# EAGLE design encoder (EAGLE 5.07)
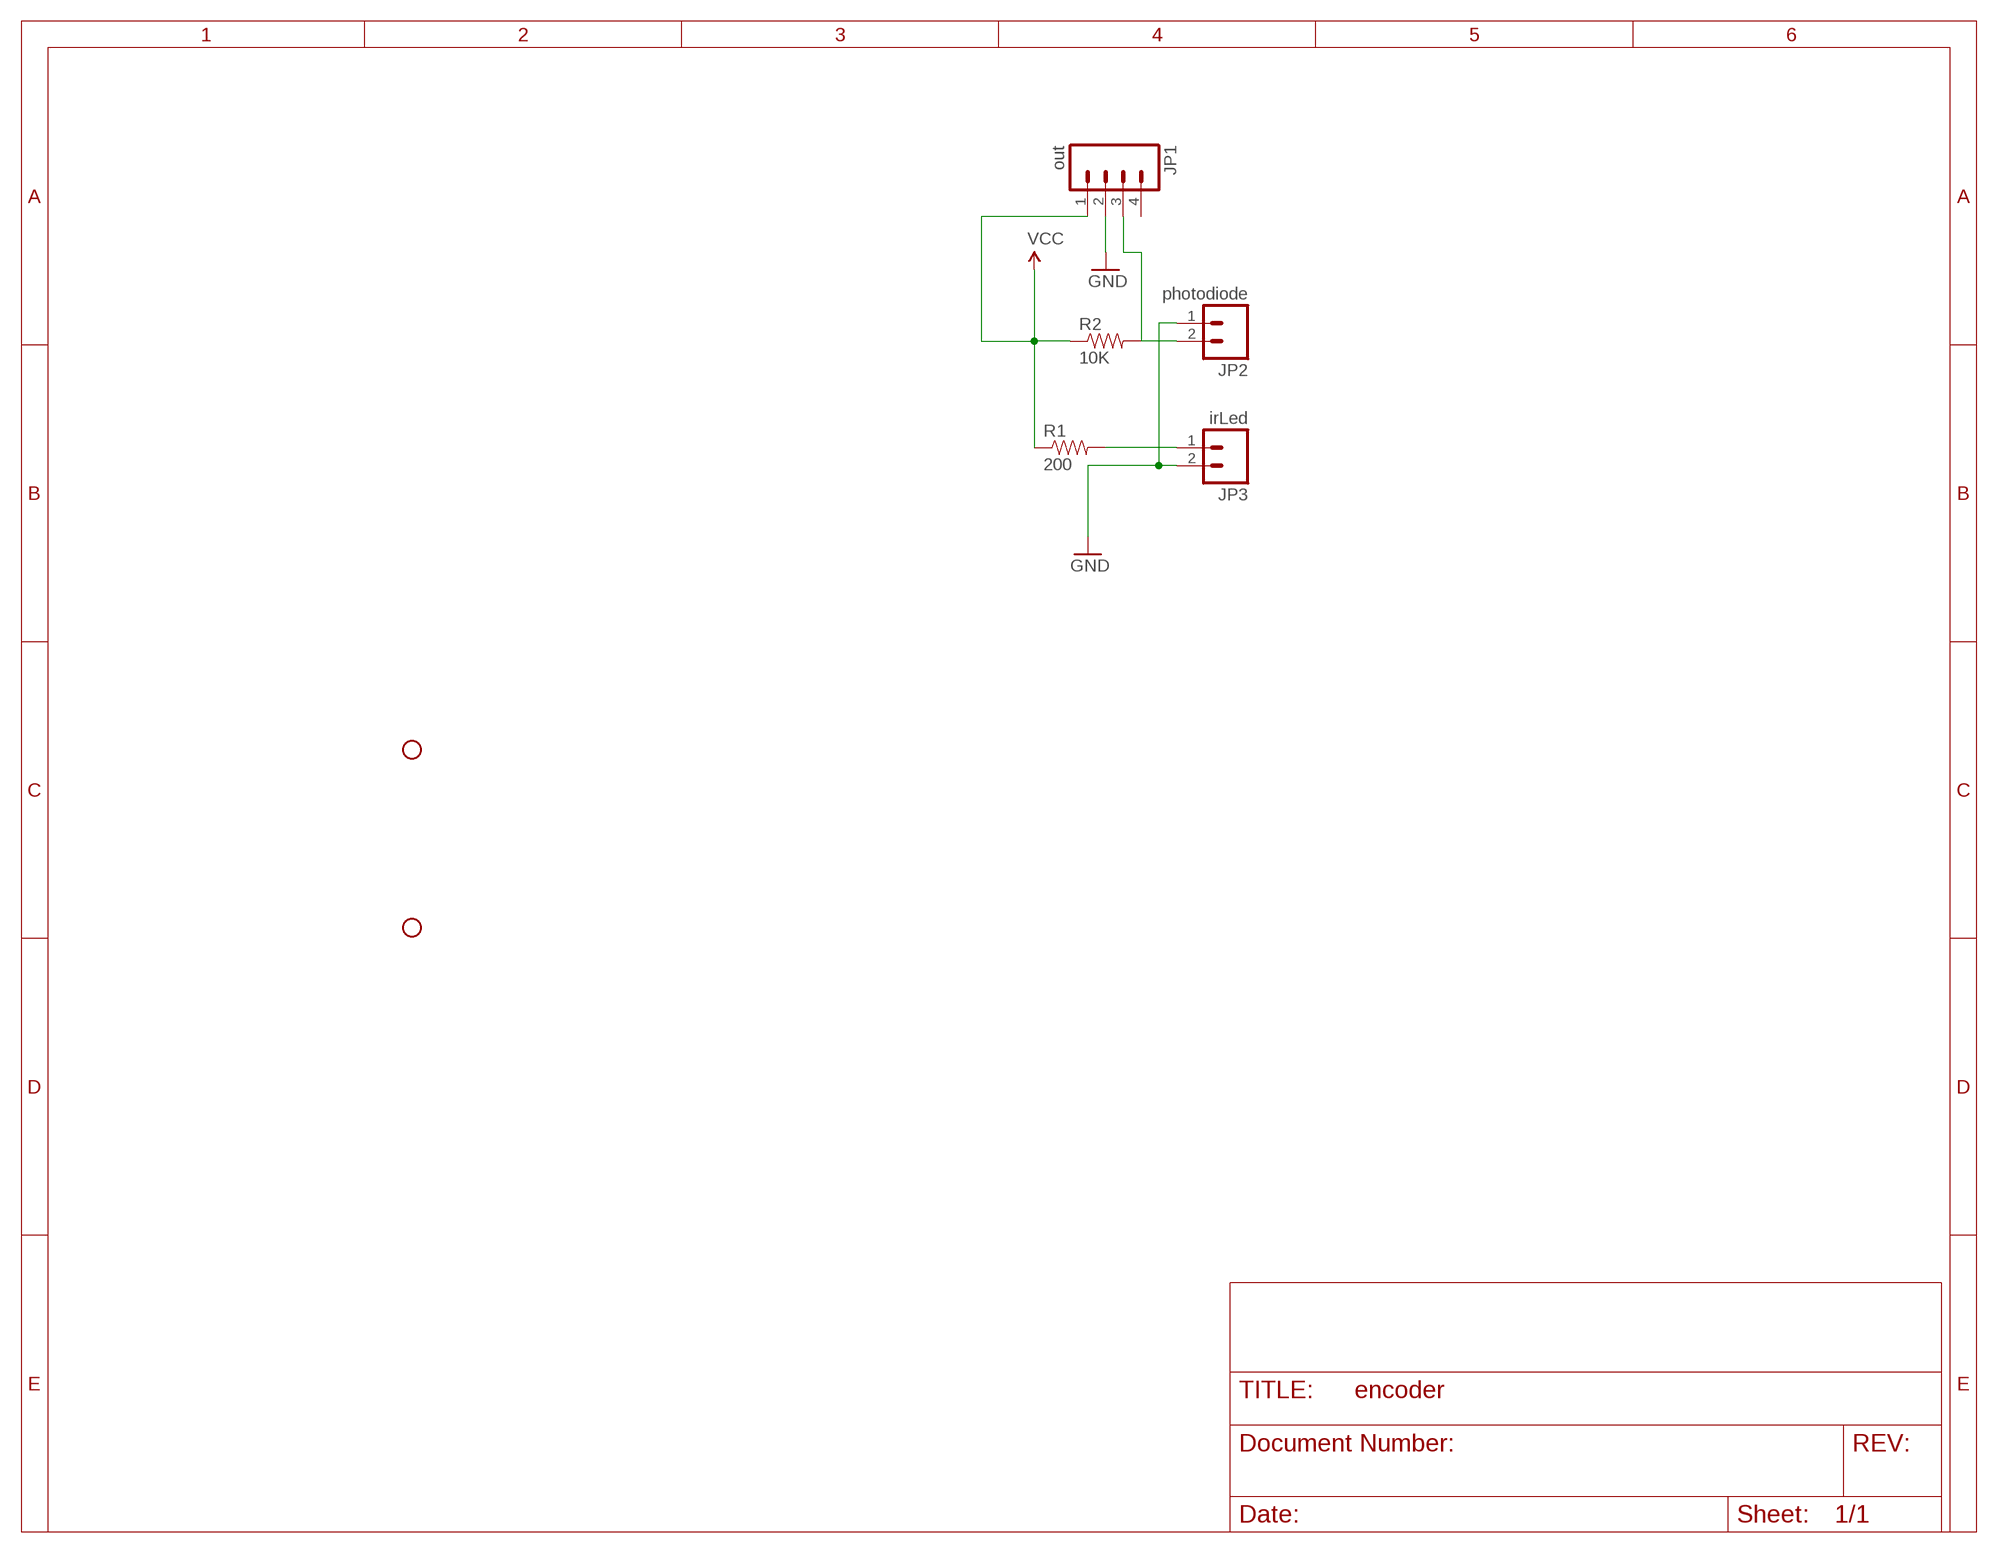
[diagram p0: schematic, sheet 1]

## Parts
JP1  out  M04POLAR  [MOLEX-1X4]
JP2  photodiode  M02PTH  [1X02]
JP3  irLed  M02PTH  [1X02]
JP9  STAND-OFF  [STAND-OFF]
JP10  STAND-OFF  [STAND-OFF]
R1  200  RESISTORPTH1  [AXIAL-0.3]
R2  10K  RESISTORPTH1  [AXIAL-0.3]

## Nets
GND: JP1.2 JP2.1 JP3.2
N$1: JP3.1 R1.P$2
N$2: JP1.3 JP2.2 R2.P$2
VCC: JP1.1 R1.P$1 R2.P$1
Unconnected: JP1.4

## Library data of the parts
JP1 = SparkFun:M04: Header 4 Standard 4-pin 0.1" header. Use with straight break away headers (SKU : PRT-00116), right angle break away headers (PRT-00553), swiss pins (PRT-00743), machine pins (PRT-00117), and female headers (PRT-00115). Molex polarized connector foot print use with SKU : PRT-08231 with associated crimp pins and housings.
JP2 JP3 = SparkFun:M02: Header 2 Standard 2-pin 0.1" header. Use with straight break away headers (SKU : PRT-00116), right angle break away headers (PRT-00553), swiss pins (PRT-00743), machine pins (PRT-00117), and female headers (PRT-00115). Molex polarized connector foot print use with SKU : PRT-08233 with associated crimp pins and housings.
JP9 JP10 = SparkFun:STAND-OFF: Stand Off This is the mechanical footprint for a #4 phillips button head screw. Use the keepout ring to avoid running the screw head into surrounding components. SKU : PRT-00447
R1 R2 = SparkFun:RESISTOR: Resistor Basic schematic elements and footprints for 0603, 1206, and PTH 1/10th watt (small) resistors.

## Net classes
0 signal: width 0.381 mm, drill 0.813 mm, clearance 0.254 mm
1 drive: width 1.778 mm, drill 0.813 mm, clearance 0.254 mm

## Board
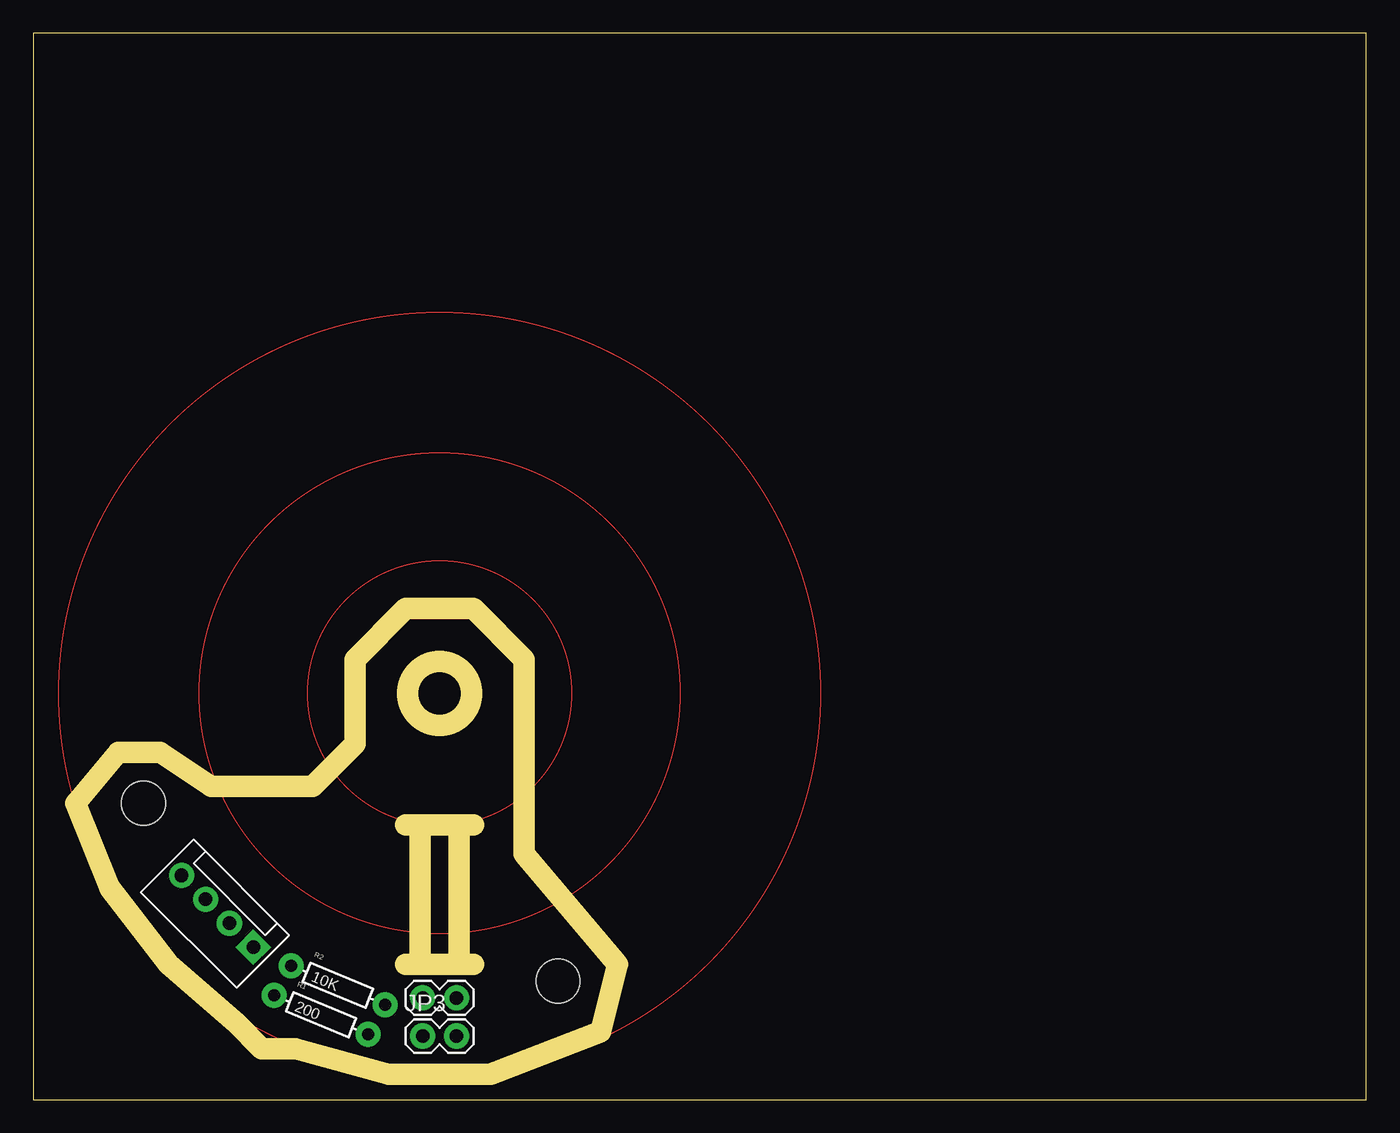
[diagram p1: board, top side]
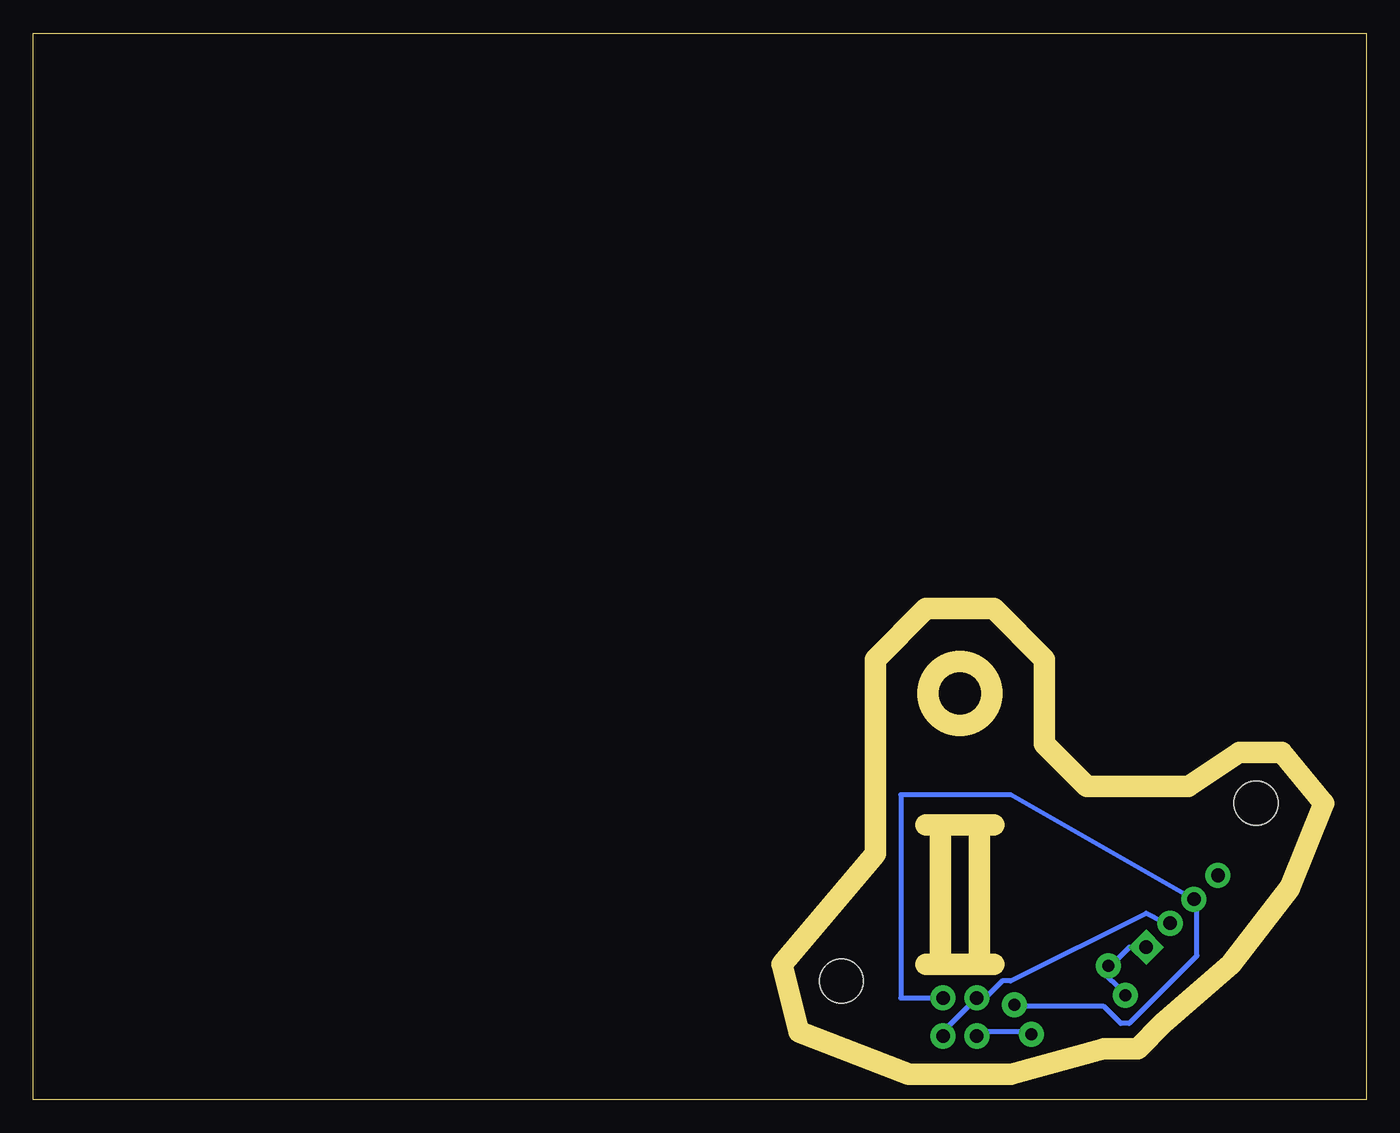
[diagram p2: board, bottom side, seen from below]

Size 100 x 80 mm. Coordinates in mm from the lower left corner, seen from the top.
Outline: 0,0 100,0 100,80 0,80 0,0
Copper layers (1*16): Top 0.035mm / dielectric 1.5mm / Bottom 0.035mm
Design rules "default *": minimum track width 15mil, minimum drill 24mil, track to track 15mil, track to pad 15mil, pad to pad 8mil, via to via 8mil, smd to smd 8mil, copper to edge 63mil, drill to drill 8mil, minimum pad ring 10mil, minimum via ring 8mil, stop-mask expansion 4mil, vias tented up to drill 0mil, thermal gap 10mil
Milling: area 28.1,28.1 to 32.9,32.9; 26 lines

### Footprints (pad centres in the part's own frame; a part is rotated, then mirrored left to right if it is on the bottom)
MOLEX-1X4 = drill 1.016 pad 1.88 square: 1 0,0 | drill 1.016 pad 1.88 round: 2 2.54,0; 3 5.08,0; 4 7.62,0
1X02 = drill 1.016 pad 1.88 round: 1 0,0; 2 2.54,0
STAND-OFF = hole 3.302: 0,0
AXIAL-0.3 = drill 0.9 pad 1.88 round: P$1 -3.81,0; P$2 3.81,0

### Placement (x,y rotation side)
JP1  16.51,11.43 135 top
JP2  29.21,7.62 0 top
JP3  29.21,4.76 0 top
JP9  39.37,8.89 0 top
JP10  8.26,22.23 0 top
R1  21.59,6.35 337.5 top
R2  22.86,8.57 337.5 top

### Tracks (layer width: path | path; a pad name or v marks a point on that pad's centre or on a via)
GND
  Bottom 0.381: JP1.2 15.24,13.34 16.51,13.97 26.67,8.89 27.3,8.89 28.57,7.62 JP2.1 31.75,5.08 JP3.2
N$1
  Bottom 0.381: R1.P$2 25.4,5.08 29.21,5.08 JP3.1
N$2
  Bottom 0.381: JP2.2 34.92,7.62 34.92,22.86 26.67,22.86 13.34,15.24 JP1.3 12.7,14.61 12.7,10.79 17.78,5.71 18.41,5.71 19.68,6.99 26.04,6.99 R2.P$2
VCC
  Bottom 0.381: JP1.1 17.78,11.43 19.05,10.16 R2.P$1 19.68,9.53 18.41,8.26 R1.P$1
(copper drawn outside any net)
  shapes: Top circle x3